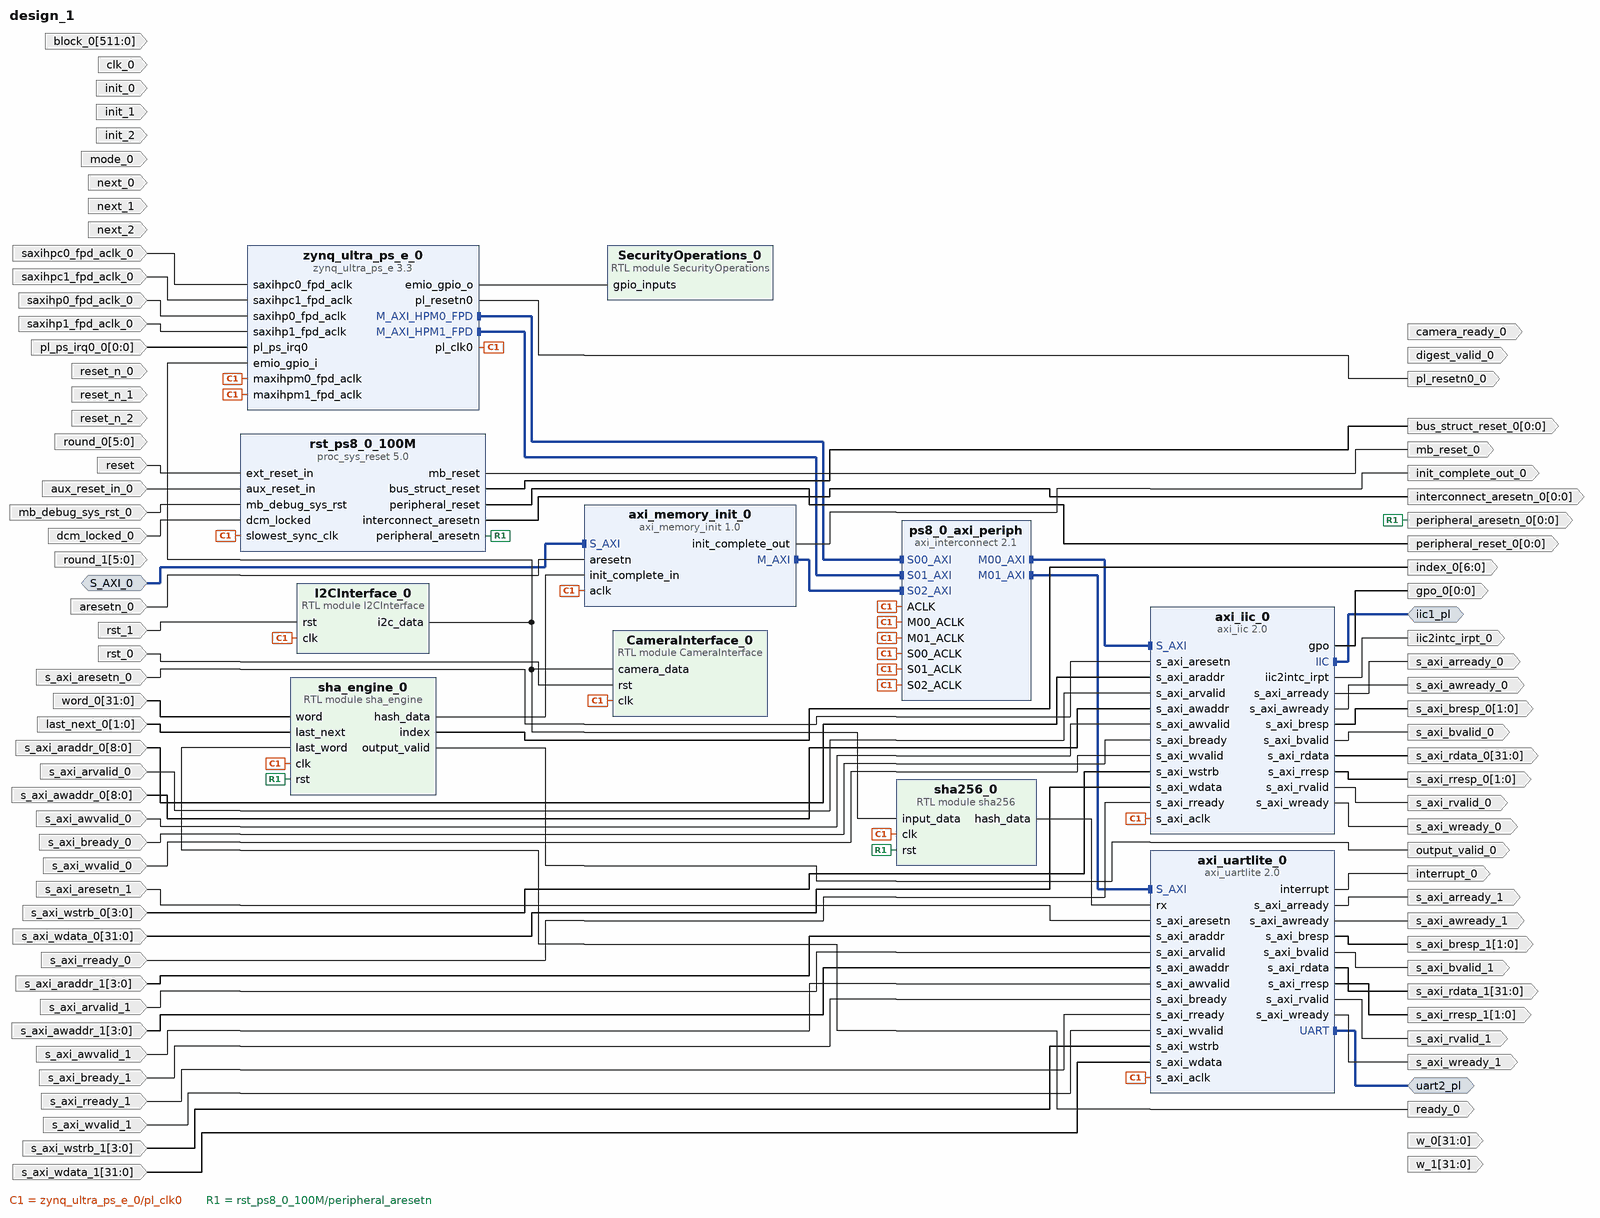
[diagram p0: block diagram of the top level]
# Vivado block design design_1, xczu7ev-ffvc1156-2-e, Vivado 2019.1
create_bd_design design_1

create_bd_intf_port -mode Master -vlnv xilinx.com:interface:iic_rtl:1.0 iic1_pl
create_bd_intf_port -mode Master -vlnv xilinx.com:interface:uart_rtl:1.0 uart2_pl
create_bd_intf_port -mode Slave -vlnv xilinx.com:interface:aximm_rtl:1.0 S_AXI_0
set_property -dict [list \
  CONFIG.ADDR_WIDTH 32 \
  CONFIG.ARUSER_WIDTH 0 \
  CONFIG.AWUSER_WIDTH 0 \
  CONFIG.BUSER_WIDTH 0 \
  CONFIG.DATA_WIDTH 32 \
  CONFIG.HAS_BRESP 1 \
  CONFIG.HAS_BURST 1 \
  CONFIG.HAS_CACHE 1 \
  CONFIG.HAS_LOCK 1 \
  CONFIG.HAS_PROT 1 \
  CONFIG.HAS_QOS 1 \
  CONFIG.HAS_REGION 1 \
  CONFIG.HAS_RRESP 1 \
  CONFIG.HAS_WSTRB 1 \
  CONFIG.ID_WIDTH 0 \
  CONFIG.MAX_BURST_LENGTH 256 \
  CONFIG.NUM_READ_OUTSTANDING 2 \
  CONFIG.NUM_READ_THREADS 1 \
  CONFIG.NUM_WRITE_OUTSTANDING 2 \
  CONFIG.NUM_WRITE_THREADS 1 \
  CONFIG.PROTOCOL AXI4 \
  CONFIG.READ_WRITE_MODE READ_WRITE \
  CONFIG.RUSER_BITS_PER_BYTE 0 \
  CONFIG.RUSER_WIDTH 0 \
  CONFIG.SUPPORTS_NARROW_BURST 1 \
  CONFIG.WUSER_BITS_PER_BYTE 0 \
  CONFIG.WUSER_WIDTH 0 \
] [get_bd_intf_ports S_AXI_0]
create_bd_port -dir O camera_ready_0
create_bd_port -dir I -type rst reset
set_property -dict {CONFIG.POLARITY ACTIVE_HIGH} [get_bd_ports reset]
create_bd_port -dir I -type clk saxihpc0_fpd_aclk_0
create_bd_port -dir I -type clk saxihpc1_fpd_aclk_0
create_bd_port -dir I -type clk saxihp0_fpd_aclk_0
create_bd_port -dir I -type clk saxihp1_fpd_aclk_0
create_bd_port -dir I -type rst rst_0
create_bd_port -dir I -type rst rst_1
create_bd_port -dir I -from 0 -to 0 -type intr pl_ps_irq0_0
set_property -dict {CONFIG.PortWidth 1} [get_bd_ports pl_ps_irq0_0]
create_bd_port -dir O -type rst pl_resetn0_0
create_bd_port -dir I -type rst reset_n_0
create_bd_port -dir I init_0
create_bd_port -dir I next_0
create_bd_port -dir I mode_0
create_bd_port -dir O ready_0
create_bd_port -dir O digest_valid_0
create_bd_port -dir I -type rst reset_n_1
create_bd_port -dir I -from 5 -to 0 round_0
create_bd_port -dir I init_1
create_bd_port -dir I next_1
create_bd_port -dir O -from 31 -to 0 w_0
create_bd_port -dir O init_complete_out_0
create_bd_port -dir I -type rst s_axi_aresetn_0
create_bd_port -dir O -type intr iic2intc_irpt_0
create_bd_port -dir O -from 0 -to 0 gpo_0
create_bd_port -dir I -type rst s_axi_aresetn_1
create_bd_port -dir O -type intr interrupt_0
create_bd_port -dir I -type rst aux_reset_in_0
create_bd_port -dir I -type rst mb_debug_sys_rst_0
set_property -dict {CONFIG.POLARITY ACTIVE_HIGH} [get_bd_ports mb_debug_sys_rst_0]
create_bd_port -dir I dcm_locked_0
create_bd_port -dir O -type rst mb_reset_0
create_bd_port -dir O -from 0 -to 0 -type rst bus_struct_reset_0
create_bd_port -dir O -from 0 -to 0 -type rst peripheral_reset_0
create_bd_port -dir O -from 0 -to 0 -type rst interconnect_aresetn_0
create_bd_port -dir O -from 0 -to 0 -type rst peripheral_aresetn_0
create_bd_port -dir I -type rst aresetn_0
create_bd_port -dir I -from 8 -to 0 s_axi_araddr_0
create_bd_port -dir O s_axi_arready_0
create_bd_port -dir I s_axi_arvalid_0
create_bd_port -dir I -from 8 -to 0 s_axi_awaddr_0
create_bd_port -dir O s_axi_awready_0
create_bd_port -dir I s_axi_awvalid_0
create_bd_port -dir I s_axi_bready_0
create_bd_port -dir O -from 1 -to 0 s_axi_bresp_0
create_bd_port -dir O s_axi_bvalid_0
create_bd_port -dir I s_axi_wvalid_0
create_bd_port -dir I -from 3 -to 0 s_axi_wstrb_0
create_bd_port -dir O s_axi_wready_0
create_bd_port -dir I -from 31 -to 0 s_axi_wdata_0
create_bd_port -dir O s_axi_rvalid_0
create_bd_port -dir O -from 31 -to 0 s_axi_rdata_0
create_bd_port -dir I s_axi_rready_0
create_bd_port -dir O -from 1 -to 0 s_axi_rresp_0
create_bd_port -dir I -from 3 -to 0 s_axi_araddr_1
create_bd_port -dir O s_axi_arready_1
create_bd_port -dir I s_axi_arvalid_1
create_bd_port -dir I -from 3 -to 0 s_axi_awaddr_1
create_bd_port -dir O s_axi_awready_1
create_bd_port -dir I s_axi_awvalid_1
create_bd_port -dir I s_axi_bready_1
create_bd_port -dir O -from 1 -to 0 s_axi_bresp_1
create_bd_port -dir O s_axi_bvalid_1
create_bd_port -dir O -from 31 -to 0 s_axi_rdata_1
create_bd_port -dir I s_axi_rready_1
create_bd_port -dir O -from 1 -to 0 s_axi_rresp_1
create_bd_port -dir O s_axi_rvalid_1
create_bd_port -dir I s_axi_wvalid_1
create_bd_port -dir I -from 3 -to 0 s_axi_wstrb_1
create_bd_port -dir O s_axi_wready_1
create_bd_port -dir I -from 31 -to 0 s_axi_wdata_1
create_bd_port -dir I -from 511 -to 0 block_0
create_bd_port -dir I -type clk clk_0
create_bd_port -dir I init_2
create_bd_port -dir I next_2
create_bd_port -dir I -type rst reset_n_2
create_bd_port -dir I -from 5 -to 0 round_1
create_bd_port -dir O -from 31 -to 0 w_1
create_bd_port -dir O -from 6 -to 0 index_0
create_bd_port -dir O output_valid_0
create_bd_port -dir I -from 31 -to 0 word_0
create_bd_port -dir I -from 1 -to 0 last_next_0

create_bd_cell -type ip -vlnv xilinx.com:ip:zynq_ultra_ps_e:3.3 zynq_ultra_ps_e_0
set_property -dict [list \
  CONFIG.PSU_BANK_0_IO_STANDARD LVCMOS18 \
  CONFIG.PSU_BANK_1_IO_STANDARD LVCMOS18 \
  CONFIG.PSU_BANK_2_IO_STANDARD LVCMOS18 \
  CONFIG.PSU_USB3__DUAL_CLOCK_ENABLE 1 \
  CONFIG.PSU__CAN1__PERIPHERAL__ENABLE 0 \
  CONFIG.PSU__CRF_APB__ACPU_CTRL__FREQMHZ 1200 \
  CONFIG.PSU__CRF_APB__ACPU_CTRL__SRCSEL APLL \
  CONFIG.PSU__CRF_APB__APLL_CTRL__SRCSEL PSS_REF_CLK \
  CONFIG.PSU__CRF_APB__DBG_FPD_CTRL__FREQMHZ 250 \
  CONFIG.PSU__CRF_APB__DBG_FPD_CTRL__SRCSEL IOPLL \
  CONFIG.PSU__CRF_APB__DBG_TRACE_CTRL__FREQMHZ 250 \
  CONFIG.PSU__CRF_APB__DBG_TRACE_CTRL__SRCSEL IOPLL \
  CONFIG.PSU__CRF_APB__DBG_TSTMP_CTRL__FREQMHZ 250 \
  CONFIG.PSU__CRF_APB__DBG_TSTMP_CTRL__SRCSEL IOPLL \
  CONFIG.PSU__CRF_APB__DDR_CTRL__FREQMHZ 1067 \
  CONFIG.PSU__CRF_APB__DDR_CTRL__SRCSEL DPLL \
  CONFIG.PSU__CRF_APB__DPDMA_REF_CTRL__FREQMHZ 600 \
  CONFIG.PSU__CRF_APB__DPDMA_REF_CTRL__SRCSEL APLL \
  CONFIG.PSU__CRF_APB__DPLL_CTRL__SRCSEL PSS_REF_CLK \
  CONFIG.PSU__CRF_APB__DP_AUDIO_REF_CTRL__SRCSEL RPLL \
  CONFIG.PSU__CRF_APB__DP_STC_REF_CTRL__SRCSEL RPLL \
  CONFIG.PSU__CRF_APB__DP_VIDEO_REF_CTRL__SRCSEL VPLL \
  CONFIG.PSU__CRF_APB__GDMA_REF_CTRL__FREQMHZ 600 \
  CONFIG.PSU__CRF_APB__GDMA_REF_CTRL__SRCSEL APLL \
  CONFIG.PSU__CRF_APB__GPU_REF_CTRL__FREQMHZ 500 \
  CONFIG.PSU__CRF_APB__GPU_REF_CTRL__SRCSEL IOPLL \
  CONFIG.PSU__CRF_APB__TOPSW_LSBUS_CTRL__FREQMHZ 100 \
  CONFIG.PSU__CRF_APB__TOPSW_LSBUS_CTRL__SRCSEL IOPLL \
  CONFIG.PSU__CRF_APB__TOPSW_MAIN_CTRL__FREQMHZ 533.33 \
  CONFIG.PSU__CRF_APB__TOPSW_MAIN_CTRL__SRCSEL DPLL \
  CONFIG.PSU__CRF_APB__VPLL_CTRL__SRCSEL PSS_REF_CLK \
  CONFIG.PSU__CRL_APB__ADMA_REF_CTRL__FREQMHZ 500 \
  CONFIG.PSU__CRL_APB__ADMA_REF_CTRL__SRCSEL IOPLL \
  CONFIG.PSU__CRL_APB__CAN1_REF_CTRL__FREQMHZ 100 \
  CONFIG.PSU__CRL_APB__CAN1_REF_CTRL__SRCSEL IOPLL \
  CONFIG.PSU__CRL_APB__CPU_R5_CTRL__FREQMHZ 500 \
  CONFIG.PSU__CRL_APB__CPU_R5_CTRL__SRCSEL IOPLL \
  CONFIG.PSU__CRL_APB__DBG_LPD_CTRL__FREQMHZ 250 \
  CONFIG.PSU__CRL_APB__DBG_LPD_CTRL__SRCSEL IOPLL \
  CONFIG.PSU__CRL_APB__GEM3_REF_CTRL__FREQMHZ 125 \
  CONFIG.PSU__CRL_APB__GEM3_REF_CTRL__SRCSEL IOPLL \
  CONFIG.PSU__CRL_APB__I2C0_REF_CTRL__FREQMHZ 100 \
  CONFIG.PSU__CRL_APB__I2C0_REF_CTRL__SRCSEL IOPLL \
  CONFIG.PSU__CRL_APB__I2C1_REF_CTRL__FREQMHZ 100 \
  CONFIG.PSU__CRL_APB__I2C1_REF_CTRL__SRCSEL IOPLL \
  CONFIG.PSU__CRL_APB__IOPLL_CTRL__SRCSEL PSS_REF_CLK \
  CONFIG.PSU__CRL_APB__IOU_SWITCH_CTRL__FREQMHZ 250 \
  CONFIG.PSU__CRL_APB__IOU_SWITCH_CTRL__SRCSEL IOPLL \
  CONFIG.PSU__CRL_APB__LPD_LSBUS_CTRL__FREQMHZ 100 \
  CONFIG.PSU__CRL_APB__LPD_LSBUS_CTRL__SRCSEL IOPLL \
  CONFIG.PSU__CRL_APB__LPD_SWITCH_CTRL__FREQMHZ 500 \
  CONFIG.PSU__CRL_APB__LPD_SWITCH_CTRL__SRCSEL IOPLL \
  CONFIG.PSU__CRL_APB__PCAP_CTRL__FREQMHZ 200 \
  CONFIG.PSU__CRL_APB__PCAP_CTRL__SRCSEL IOPLL \
  CONFIG.PSU__CRL_APB__PL0_REF_CTRL__FREQMHZ 100 \
  CONFIG.PSU__CRL_APB__PL0_REF_CTRL__SRCSEL IOPLL \
  CONFIG.PSU__CRL_APB__QSPI_REF_CTRL__FREQMHZ 125 \
  CONFIG.PSU__CRL_APB__QSPI_REF_CTRL__SRCSEL IOPLL \
  CONFIG.PSU__CRL_APB__RPLL_CTRL__SRCSEL PSS_REF_CLK \
  CONFIG.PSU__CRL_APB__SDIO1_REF_CTRL__FREQMHZ 200 \
  CONFIG.PSU__CRL_APB__SDIO1_REF_CTRL__SRCSEL IOPLL \
  CONFIG.PSU__CRL_APB__TIMESTAMP_REF_CTRL__FREQMHZ 100 \
  CONFIG.PSU__CRL_APB__TIMESTAMP_REF_CTRL__SRCSEL IOPLL \
  CONFIG.PSU__CRL_APB__UART0_REF_CTRL__FREQMHZ 100 \
  CONFIG.PSU__CRL_APB__UART0_REF_CTRL__SRCSEL IOPLL \
  CONFIG.PSU__CRL_APB__UART1_REF_CTRL__FREQMHZ 100 \
  CONFIG.PSU__CRL_APB__UART1_REF_CTRL__SRCSEL IOPLL \
  CONFIG.PSU__CRL_APB__USB0_BUS_REF_CTRL__FREQMHZ 250 \
  CONFIG.PSU__CRL_APB__USB0_BUS_REF_CTRL__SRCSEL IOPLL \
  CONFIG.PSU__CRL_APB__USB3_DUAL_REF_CTRL__FREQMHZ 20 \
  CONFIG.PSU__CRL_APB__USB3_DUAL_REF_CTRL__SRCSEL IOPLL \
  CONFIG.PSU__CRL_APB__USB3__ENABLE 1 \
  CONFIG.PSU__DDRC__BUS_WIDTH {64 Bit} \
  CONFIG.PSU__DDRC__COMPONENTS Components \
  CONFIG.PSU__DDRC__DEVICE_CAPACITY {4096 MBits} \
  CONFIG.PSU__DDRC__DRAM_WIDTH {16 Bits} \
  CONFIG.PSU__DDRC__ECC Disabled \
  CONFIG.PSU__DDRC__MEMORY_TYPE {DDR 4} \
  CONFIG.PSU__DDRC__SPEED_BIN DDR4_2133P \
  CONFIG.PSU__DDR_HIGH_ADDRESS_GUI_ENABLE 0 \
  CONFIG.PSU__DDR__INTERFACE__FREQMHZ 533.500 \
  CONFIG.PSU__DISPLAYPORT__LANE0__ENABLE 1 \
  CONFIG.PSU__DISPLAYPORT__LANE0__IO {GT Lane1} \
  CONFIG.PSU__DISPLAYPORT__LANE1__ENABLE 1 \
  CONFIG.PSU__DISPLAYPORT__LANE1__IO {GT Lane0} \
  CONFIG.PSU__DISPLAYPORT__PERIPHERAL__ENABLE 1 \
  CONFIG.PSU__DLL__ISUSED 1 \
  CONFIG.PSU__DPAUX__PERIPHERAL__ENABLE 1 \
  CONFIG.PSU__DPAUX__PERIPHERAL__IO {MIO 27 .. 30} \
  CONFIG.PSU__DP__LANE_SEL {Dual Lower} \
  CONFIG.PSU__DP__REF_CLK_FREQ 27 \
  CONFIG.PSU__DP__REF_CLK_SEL {Ref Clk3} \
  CONFIG.PSU__ENET3__FIFO__ENABLE 0 \
  CONFIG.PSU__ENET3__GRP_MDIO__ENABLE 1 \
  CONFIG.PSU__ENET3__GRP_MDIO__IO {MIO 76 .. 77} \
  CONFIG.PSU__ENET3__PERIPHERAL__ENABLE 1 \
  CONFIG.PSU__ENET3__PERIPHERAL__IO {MIO 64 .. 75} \
  CONFIG.PSU__ENET3__PTP__ENABLE 0 \
  CONFIG.PSU__ENET3__TSU__ENABLE 0 \
  CONFIG.PSU__FPGA_PL0_ENABLE 1 \
  CONFIG.PSU__FTM__GPI 1 \
  CONFIG.PSU__FTM__GPO 1 \
  CONFIG.PSU__GEM3_COHERENCY 0 \
  CONFIG.PSU__GEM3_ROUTE_THROUGH_FPD 0 \
  CONFIG.PSU__GEM__TSU__ENABLE 0 \
  CONFIG.PSU__GPIO0_MIO__PERIPHERAL__ENABLE 0 \
  CONFIG.PSU__GPIO1_MIO__PERIPHERAL__ENABLE 0 \
  CONFIG.PSU__GPIO_EMIO_WIDTH 6 \
  CONFIG.PSU__GPIO_EMIO__PERIPHERAL__ENABLE 1 \
  CONFIG.PSU__GPIO_EMIO__PERIPHERAL__IO 6 \
  CONFIG.PSU__GT__LINK_SPEED HBR \
  CONFIG.PSU__GT__PRE_EMPH_LVL_4 0 \
  CONFIG.PSU__GT__VLT_SWNG_LVL_4 0 \
  CONFIG.PSU__I2C0__PERIPHERAL__ENABLE 0 \
  CONFIG.PSU__I2C1__PERIPHERAL__ENABLE 1 \
  CONFIG.PSU__I2C1__PERIPHERAL__IO {MIO 16 .. 17} \
  CONFIG.PSU__IOU_SLCR__IOU_TTC_APB_CLK__TTC0_SEL APB \
  CONFIG.PSU__IOU_SLCR__IOU_TTC_APB_CLK__TTC1_SEL APB \
  CONFIG.PSU__IOU_SLCR__IOU_TTC_APB_CLK__TTC2_SEL APB \
  CONFIG.PSU__IOU_SLCR__IOU_TTC_APB_CLK__TTC3_SEL APB \
  CONFIG.PSU__LPD_SLCR__CSUPMU__FREQMHZ 100 \
  CONFIG.PSU__MAXIGP0__DATA_WIDTH 128 \
  CONFIG.PSU__OVERRIDE__BASIC_CLOCK 0 \
  CONFIG.PSU__PMU__PERIPHERAL__ENABLE 0 \
  CONFIG.PSU__PRESET_APPLIED 1 \
  CONFIG.PSU__PSS_REF_CLK__FREQMHZ 33.333333 \
  CONFIG.PSU__QSPI_COHERENCY 0 \
  CONFIG.PSU__QSPI_ROUTE_THROUGH_FPD 0 \
  CONFIG.PSU__QSPI__GRP_FBCLK__ENABLE 1 \
  CONFIG.PSU__QSPI__GRP_FBCLK__IO {MIO 6} \
  CONFIG.PSU__QSPI__PERIPHERAL__DATA_MODE x4 \
  CONFIG.PSU__QSPI__PERIPHERAL__ENABLE 1 \
  CONFIG.PSU__QSPI__PERIPHERAL__IO {MIO 0 .. 5} \
  CONFIG.PSU__QSPI__PERIPHERAL__MODE Single \
  CONFIG.PSU__SATA__LANE1__IO {GT Lane3} \
  CONFIG.PSU__SATA__PERIPHERAL__ENABLE 1 \
  CONFIG.PSU__SATA__REF_CLK_FREQ 125 \
  CONFIG.PSU__SATA__REF_CLK_SEL {Ref Clk1} \
  CONFIG.PSU__SD1_COHERENCY 0 \
  CONFIG.PSU__SD1_ROUTE_THROUGH_FPD 0 \
  CONFIG.PSU__SD1__DATA_TRANSFER_MODE 4Bit \
  CONFIG.PSU__SD1__GRP_CD__ENABLE 1 \
  CONFIG.PSU__SD1__GRP_CD__IO {MIO 45} \
  CONFIG.PSU__SD1__GRP_POW__ENABLE 0 \
  CONFIG.PSU__SD1__GRP_WP__ENABLE 0 \
  CONFIG.PSU__SD1__PERIPHERAL__ENABLE 1 \
  CONFIG.PSU__SD1__PERIPHERAL__IO {MIO 46 .. 51} \
  CONFIG.PSU__SD1__SLOT_TYPE {SD 2.0} \
  CONFIG.PSU__SWDT0__CLOCK__ENABLE 0 \
  CONFIG.PSU__SWDT0__PERIPHERAL__ENABLE 1 \
  CONFIG.PSU__SWDT0__RESET__ENABLE 0 \
  CONFIG.PSU__SWDT1__CLOCK__ENABLE 0 \
  CONFIG.PSU__SWDT1__PERIPHERAL__ENABLE 1 \
  CONFIG.PSU__SWDT1__RESET__ENABLE 0 \
  CONFIG.PSU__TSU__BUFG_PORT_PAIR 0 \
  CONFIG.PSU__TTC0__CLOCK__ENABLE 0 \
  CONFIG.PSU__TTC0__PERIPHERAL__ENABLE 1 \
  CONFIG.PSU__TTC0__WAVEOUT__ENABLE 0 \
  CONFIG.PSU__TTC1__CLOCK__ENABLE 0 \
  CONFIG.PSU__TTC1__PERIPHERAL__ENABLE 1 \
  CONFIG.PSU__TTC1__WAVEOUT__ENABLE 0 \
  CONFIG.PSU__TTC2__CLOCK__ENABLE 0 \
  CONFIG.PSU__TTC2__PERIPHERAL__ENABLE 1 \
  CONFIG.PSU__TTC2__WAVEOUT__ENABLE 0 \
  CONFIG.PSU__TTC3__CLOCK__ENABLE 0 \
  CONFIG.PSU__TTC3__PERIPHERAL__ENABLE 1 \
  CONFIG.PSU__TTC3__WAVEOUT__ENABLE 0 \
  CONFIG.PSU__UART0__BAUD_RATE 115200 \
  CONFIG.PSU__UART0__MODEM__ENABLE 0 \
  CONFIG.PSU__UART0__PERIPHERAL__ENABLE 1 \
  CONFIG.PSU__UART0__PERIPHERAL__IO {MIO 18 .. 19} \
  CONFIG.PSU__UART1__BAUD_RATE 115200 \
  CONFIG.PSU__UART1__MODEM__ENABLE 0 \
  CONFIG.PSU__UART1__PERIPHERAL__ENABLE 1 \
  CONFIG.PSU__UART1__PERIPHERAL__IO {MIO 20 .. 21} \
  CONFIG.PSU__USB0_COHERENCY 0 \
  CONFIG.PSU__USB0__PERIPHERAL__ENABLE 1 \
  CONFIG.PSU__USB0__PERIPHERAL__IO {MIO 52 .. 63} \
  CONFIG.PSU__USB0__REF_CLK_FREQ 26 \
  CONFIG.PSU__USB0__REF_CLK_SEL {Ref Clk2} \
  CONFIG.PSU__USB2_0__EMIO__ENABLE 0 \
  CONFIG.PSU__USB3_0__EMIO__ENABLE 0 \
  CONFIG.PSU__USB3_0__PERIPHERAL__ENABLE 1 \
  CONFIG.PSU__USB3_0__PERIPHERAL__IO {GT Lane2} \
  CONFIG.PSU__USB__RESET__MODE {Boot Pin} \
  CONFIG.PSU__USB__RESET__POLARITY {Active Low} \
  CONFIG.PSU__USE__IRQ0 1 \
  CONFIG.PSU__USE__M_AXI_GP0 1 \
  CONFIG.PSU__USE__M_AXI_GP1 1 \
  CONFIG.PSU__USE__M_AXI_GP2 0 \
  CONFIG.PSU__USE__S_AXI_GP0 1 \
  CONFIG.PSU__USE__S_AXI_GP1 1 \
  CONFIG.PSU__USE__S_AXI_GP2 1 \
  CONFIG.PSU__USE__S_AXI_GP3 1 \
  CONFIG.SUBPRESET1 Custom \
] [get_bd_cells zynq_ultra_ps_e_0]
# 129 more settings of zynq_ultra_ps_e_0 are not shown: defaults, MIO pin electricals, DDR timing, and values the tool derives
create_bd_cell -type ip -vlnv xilinx.com:ip:axi_iic:2.0 axi_iic_0
set_property -dict {CONFIG.IIC_BOARD_INTERFACE iic1_pl CONFIG.USE_BOARD_FLOW true} [get_bd_cells axi_iic_0]
create_bd_cell -type ip -vlnv xilinx.com:ip:axi_memory_init:1.0 axi_memory_init_0
create_bd_cell -type ip -vlnv xilinx.com:ip:axi_uartlite:2.0 axi_uartlite_0
set_property -dict {CONFIG.UARTLITE_BOARD_INTERFACE uart2_pl CONFIG.USE_BOARD_FLOW true} [get_bd_cells axi_uartlite_0]
create_bd_cell -type ip -vlnv xilinx.com:ip:axi_interconnect:2.1 ps8_0_axi_periph
set_property -dict {CONFIG.NUM_MI 2 CONFIG.NUM_SI 3} [get_bd_cells ps8_0_axi_periph]
create_bd_cell -type ip -vlnv xilinx.com:ip:proc_sys_reset:5.0 rst_ps8_0_100M
set_property -dict {CONFIG.RESET_BOARD_INTERFACE reset CONFIG.USE_BOARD_FLOW true} [get_bd_cells rst_ps8_0_100M]
create_bd_cell -type module -reference CameraInterface CameraInterface_0
create_bd_cell -type module -reference I2CInterface I2CInterface_0
create_bd_cell -type module -reference SecurityOperations SecurityOperations_0
create_bd_cell -type module -reference sha_engine sha_engine_0
create_bd_cell -type module -reference sha256 sha256_0

# ---- connections ----

connect_bd_intf_net -intf_net S_AXI_0_1 [get_bd_intf_ports S_AXI_0] [get_bd_intf_pins axi_memory_init_0/S_AXI]
connect_bd_intf_net [get_bd_intf_pins ps8_0_axi_periph/M00_AXI] [get_bd_intf_pins axi_iic_0/S_AXI]
connect_bd_intf_net [get_bd_intf_pins zynq_ultra_ps_e_0/M_AXI_HPM0_FPD] [get_bd_intf_pins ps8_0_axi_periph/S00_AXI]
connect_bd_intf_net [get_bd_intf_pins ps8_0_axi_periph/M01_AXI] [get_bd_intf_pins axi_uartlite_0/S_AXI]
connect_bd_intf_net [get_bd_intf_pins zynq_ultra_ps_e_0/M_AXI_HPM1_FPD] [get_bd_intf_pins ps8_0_axi_periph/S01_AXI]
connect_bd_intf_net [get_bd_intf_ports iic1_pl] [get_bd_intf_pins axi_iic_0/IIC]
connect_bd_intf_net [get_bd_intf_pins axi_memory_init_0/M_AXI] [get_bd_intf_pins ps8_0_axi_periph/S02_AXI]
connect_bd_intf_net [get_bd_intf_ports uart2_pl] [get_bd_intf_pins axi_uartlite_0/UART]
connect_bd_net [get_bd_pins zynq_ultra_ps_e_0/pl_clk0] \
  [get_bd_pins zynq_ultra_ps_e_0/maxihpm0_fpd_aclk] [get_bd_pins ps8_0_axi_periph/S00_ACLK] \
  [get_bd_pins axi_iic_0/s_axi_aclk] [get_bd_pins ps8_0_axi_periph/M00_ACLK] [get_bd_pins ps8_0_axi_periph/ACLK] \
  [get_bd_pins zynq_ultra_ps_e_0/maxihpm1_fpd_aclk] [get_bd_pins ps8_0_axi_periph/S01_ACLK] \
  [get_bd_pins axi_uartlite_0/s_axi_aclk] [get_bd_pins ps8_0_axi_periph/M01_ACLK] [get_bd_pins ps8_0_axi_periph/S02_ACLK] \
  [get_bd_pins axi_memory_init_0/aclk] [get_bd_pins rst_ps8_0_100M/slowest_sync_clk] [get_bd_pins CameraInterface_0/clk] \
  [get_bd_pins I2CInterface_0/clk] [get_bd_pins sha_engine_0/clk] [get_bd_pins sha256_0/clk]
connect_bd_net [get_bd_ports reset] [get_bd_pins rst_ps8_0_100M/ext_reset_in]
connect_bd_net [get_bd_pins zynq_ultra_ps_e_0/emio_gpio_o] [get_bd_pins SecurityOperations_0/gpio_inputs]
connect_bd_net -net saxihpc0_fpd_aclk_0_1 [get_bd_ports saxihpc0_fpd_aclk_0] [get_bd_pins zynq_ultra_ps_e_0/saxihpc0_fpd_aclk]
connect_bd_net -net saxihpc1_fpd_aclk_0_1 [get_bd_ports saxihpc1_fpd_aclk_0] [get_bd_pins zynq_ultra_ps_e_0/saxihpc1_fpd_aclk]
connect_bd_net -net saxihp0_fpd_aclk_0_1 [get_bd_ports saxihp0_fpd_aclk_0] [get_bd_pins zynq_ultra_ps_e_0/saxihp0_fpd_aclk]
connect_bd_net -net saxihp1_fpd_aclk_0_1 [get_bd_ports saxihp1_fpd_aclk_0] [get_bd_pins zynq_ultra_ps_e_0/saxihp1_fpd_aclk]
connect_bd_net -net rst_0_1 [get_bd_ports rst_0] [get_bd_pins CameraInterface_0/rst]
connect_bd_net -net rst_1_1 [get_bd_ports rst_1] [get_bd_pins I2CInterface_0/rst]
connect_bd_net -net pl_ps_irq0_0_1 [get_bd_ports pl_ps_irq0_0] [get_bd_pins zynq_ultra_ps_e_0/pl_ps_irq0]
connect_bd_net [get_bd_pins zynq_ultra_ps_e_0/pl_resetn0] [get_bd_ports pl_resetn0_0]
connect_bd_net [get_bd_pins axi_memory_init_0/init_complete_out] [get_bd_ports init_complete_out_0]
connect_bd_net -net s_axi_aresetn_0_1 [get_bd_ports s_axi_aresetn_0] [get_bd_pins axi_iic_0/s_axi_aresetn]
connect_bd_net [get_bd_pins axi_iic_0/iic2intc_irpt] [get_bd_ports iic2intc_irpt_0]
connect_bd_net [get_bd_pins axi_iic_0/gpo] [get_bd_ports gpo_0]
connect_bd_net -net s_axi_aresetn_1_1 [get_bd_ports s_axi_aresetn_1] [get_bd_pins axi_uartlite_0/s_axi_aresetn]
connect_bd_net [get_bd_pins axi_uartlite_0/interrupt] [get_bd_ports interrupt_0]
connect_bd_net -net aux_reset_in_0_1 [get_bd_ports aux_reset_in_0] [get_bd_pins rst_ps8_0_100M/aux_reset_in]
connect_bd_net -net mb_debug_sys_rst_0_1 [get_bd_ports mb_debug_sys_rst_0] [get_bd_pins rst_ps8_0_100M/mb_debug_sys_rst]
connect_bd_net -net dcm_locked_0_1 [get_bd_ports dcm_locked_0] [get_bd_pins rst_ps8_0_100M/dcm_locked]
connect_bd_net [get_bd_pins rst_ps8_0_100M/mb_reset] [get_bd_ports mb_reset_0]
connect_bd_net [get_bd_pins rst_ps8_0_100M/bus_struct_reset] [get_bd_ports bus_struct_reset_0]
connect_bd_net [get_bd_pins rst_ps8_0_100M/peripheral_reset] [get_bd_ports peripheral_reset_0]
connect_bd_net [get_bd_pins rst_ps8_0_100M/interconnect_aresetn] [get_bd_ports interconnect_aresetn_0]
connect_bd_net [get_bd_pins rst_ps8_0_100M/peripheral_aresetn] \
  [get_bd_ports peripheral_aresetn_0] [get_bd_pins sha_engine_0/rst] [get_bd_pins sha256_0/rst]
connect_bd_net -net aresetn_0_1 [get_bd_ports aresetn_0] [get_bd_pins axi_memory_init_0/aresetn]
connect_bd_net -net s_axi_araddr_0_1 [get_bd_ports s_axi_araddr_0] [get_bd_pins axi_iic_0/s_axi_araddr]
connect_bd_net [get_bd_pins axi_iic_0/s_axi_arready] [get_bd_ports s_axi_arready_0]
connect_bd_net -net s_axi_arvalid_0_1 [get_bd_ports s_axi_arvalid_0] [get_bd_pins axi_iic_0/s_axi_arvalid]
connect_bd_net -net s_axi_awaddr_0_1 [get_bd_ports s_axi_awaddr_0] [get_bd_pins axi_iic_0/s_axi_awaddr]
connect_bd_net [get_bd_pins axi_iic_0/s_axi_awready] [get_bd_ports s_axi_awready_0]
connect_bd_net -net s_axi_awvalid_0_1 [get_bd_ports s_axi_awvalid_0] [get_bd_pins axi_iic_0/s_axi_awvalid]
connect_bd_net -net s_axi_bready_0_1 [get_bd_ports s_axi_bready_0] [get_bd_pins axi_iic_0/s_axi_bready]
connect_bd_net [get_bd_pins axi_iic_0/s_axi_bresp] [get_bd_ports s_axi_bresp_0]
connect_bd_net [get_bd_pins axi_iic_0/s_axi_bvalid] [get_bd_ports s_axi_bvalid_0]
connect_bd_net -net s_axi_wvalid_0_1 [get_bd_ports s_axi_wvalid_0] [get_bd_pins axi_iic_0/s_axi_wvalid]
connect_bd_net -net s_axi_wstrb_0_1 [get_bd_ports s_axi_wstrb_0] [get_bd_pins axi_iic_0/s_axi_wstrb]
connect_bd_net [get_bd_pins axi_iic_0/s_axi_wready] [get_bd_ports s_axi_wready_0]
connect_bd_net -net s_axi_wdata_0_1 [get_bd_ports s_axi_wdata_0] [get_bd_pins axi_iic_0/s_axi_wdata]
connect_bd_net [get_bd_pins axi_iic_0/s_axi_rvalid] [get_bd_ports s_axi_rvalid_0]
connect_bd_net [get_bd_pins axi_iic_0/s_axi_rdata] [get_bd_ports s_axi_rdata_0]
connect_bd_net -net s_axi_rready_0_1 [get_bd_ports s_axi_rready_0] [get_bd_pins axi_iic_0/s_axi_rready]
connect_bd_net [get_bd_pins axi_iic_0/s_axi_rresp] [get_bd_ports s_axi_rresp_0]
connect_bd_net -net s_axi_araddr_1_1 [get_bd_ports s_axi_araddr_1] [get_bd_pins axi_uartlite_0/s_axi_araddr]
connect_bd_net [get_bd_pins axi_uartlite_0/s_axi_arready] [get_bd_ports s_axi_arready_1]
connect_bd_net -net s_axi_arvalid_1_1 [get_bd_ports s_axi_arvalid_1] [get_bd_pins axi_uartlite_0/s_axi_arvalid]
connect_bd_net -net s_axi_awaddr_1_1 [get_bd_ports s_axi_awaddr_1] [get_bd_pins axi_uartlite_0/s_axi_awaddr]
connect_bd_net [get_bd_pins axi_uartlite_0/s_axi_awready] [get_bd_ports s_axi_awready_1]
connect_bd_net -net s_axi_awvalid_1_1 [get_bd_ports s_axi_awvalid_1] [get_bd_pins axi_uartlite_0/s_axi_awvalid]
connect_bd_net -net s_axi_bready_1_1 [get_bd_ports s_axi_bready_1] [get_bd_pins axi_uartlite_0/s_axi_bready]
connect_bd_net [get_bd_pins axi_uartlite_0/s_axi_bresp] [get_bd_ports s_axi_bresp_1]
connect_bd_net [get_bd_pins axi_uartlite_0/s_axi_bvalid] [get_bd_ports s_axi_bvalid_1]
connect_bd_net [get_bd_pins axi_uartlite_0/s_axi_rdata] [get_bd_ports s_axi_rdata_1]
connect_bd_net -net s_axi_rready_1_1 [get_bd_ports s_axi_rready_1] [get_bd_pins axi_uartlite_0/s_axi_rready]
connect_bd_net [get_bd_pins axi_uartlite_0/s_axi_rresp] [get_bd_ports s_axi_rresp_1]
connect_bd_net [get_bd_pins axi_uartlite_0/s_axi_rvalid] [get_bd_ports s_axi_rvalid_1]
connect_bd_net -net s_axi_wvalid_1_1 [get_bd_ports s_axi_wvalid_1] [get_bd_pins axi_uartlite_0/s_axi_wvalid]
connect_bd_net -net s_axi_wstrb_1_1 [get_bd_ports s_axi_wstrb_1] [get_bd_pins axi_uartlite_0/s_axi_wstrb]
connect_bd_net [get_bd_pins axi_uartlite_0/s_axi_wready] [get_bd_ports s_axi_wready_1]
connect_bd_net -net s_axi_wdata_1_1 [get_bd_ports s_axi_wdata_1] [get_bd_pins axi_uartlite_0/s_axi_wdata]
connect_bd_net -net sha256_core_0_ready [get_bd_ports ready_0] [get_bd_pins sha_engine_0/last_word]
connect_bd_net [get_bd_pins I2CInterface_0/i2c_data] \
  [get_bd_pins zynq_ultra_ps_e_0/emio_gpio_i] [get_bd_pins CameraInterface_0/camera_data] [get_bd_pins sha256_0/input_data]
connect_bd_net [get_bd_pins sha_engine_0/hash_data] [get_bd_pins axi_memory_init_0/init_complete_in]
connect_bd_net [get_bd_pins sha256_0/hash_data] [get_bd_pins axi_uartlite_0/rx]
connect_bd_net [get_bd_pins sha_engine_0/index] [get_bd_ports index_0]
connect_bd_net [get_bd_pins sha_engine_0/output_valid] [get_bd_ports output_valid_0]
connect_bd_net -net word_0_1 [get_bd_ports word_0] [get_bd_pins sha_engine_0/word]
connect_bd_net -net last_next_0_1 [get_bd_ports last_next_0] [get_bd_pins sha_engine_0/last_next]

# ---- address map ----
assign_bd_address -offset 0x00A0000000 -range 4K -target_address_space [get_bd_addr_spaces zynq_ultra_ps_e_0/Data] [get_bd_addr_segs axi_iic_0/S_AXI/Reg]
assign_bd_address -offset 0x00A0001000 -range 4K -target_address_space [get_bd_addr_spaces zynq_ultra_ps_e_0/Data] [get_bd_addr_segs axi_uartlite_0/S_AXI/Reg]

validate_bd_design
save_bd_design
